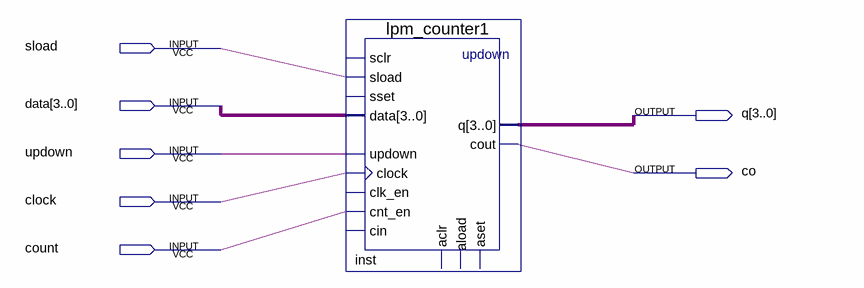
[diagram p0: schematic sheet]
// Quartus schematic Example2.bdf as structural Verilog: 1 symbols, 7 pins
module Example2 (
  input  sload,
  input  [3:0] data,
  input  updown,
  input  clock,
  input  count,
  output [3:0] q,
  output co
);

  lpm_counter1 inst (
    .sload(sload), .data(data), .updown(updown), .clock(clock), .cnt_en(count), .cout(co), .q(q));  // open: sclr, sset, clk_en, cin, aclr, aload, aset
endmodule
